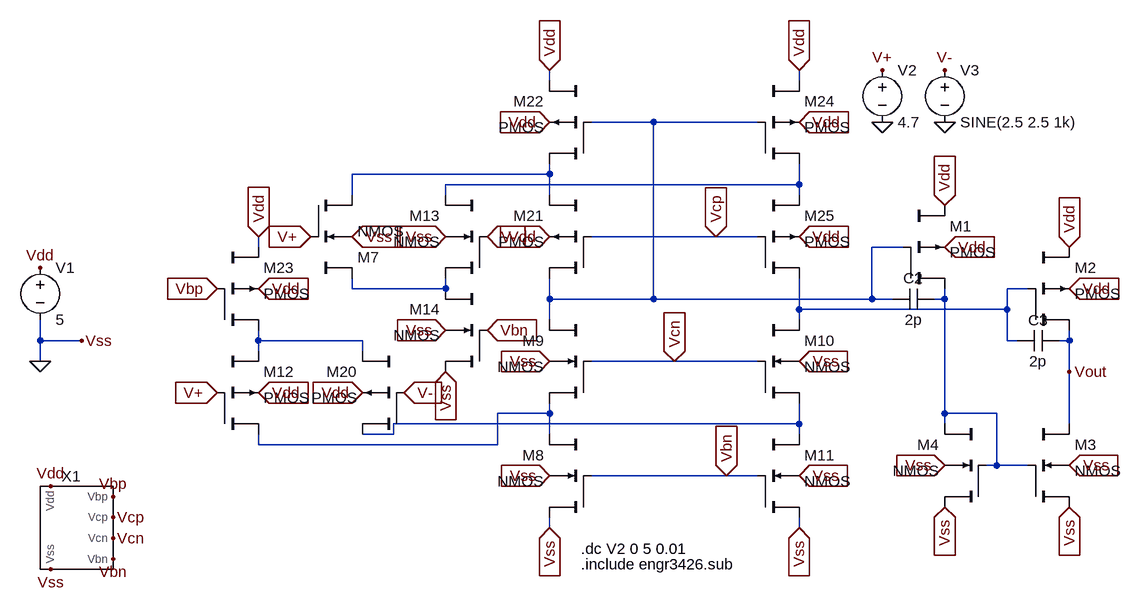
[diagram p0: schematic ampsim.asc]
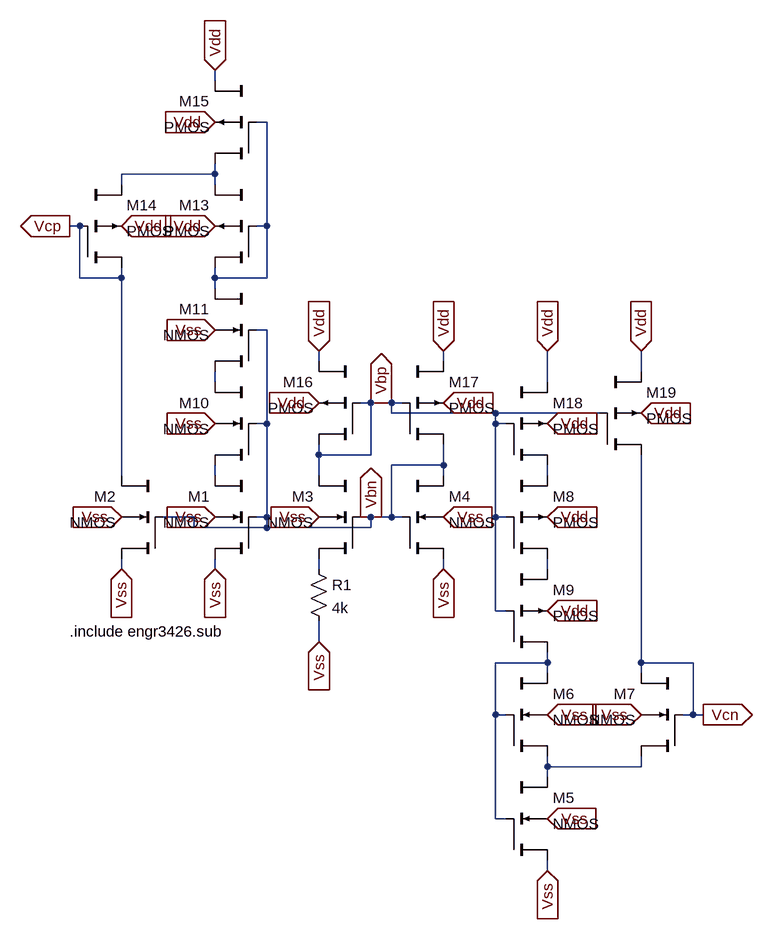
[diagram p1: sub-circuit bias.asc]
ampsim.asc, the LTspice schematic file:
Version 4
SHEET 1 2380 680
WIRE 1040 -512 1040 -528
WIRE 1424 -512 1424 -528
WIRE 1200 -448 1104 -448
WIRE 1360 -448 1200 -448
WIRE 1040 -368 1040 -384
WIRE 1040 -368 736 -368
WIRE 1424 -352 1424 -384
WIRE 1424 -352 880 -352
WIRE 736 -336 736 -368
WIRE 880 -336 880 -352
WIRE 1040 -336 1040 -368
WIRE 1424 -336 1424 -352
WIRE 1296 -272 1104 -272
WIRE 1360 -272 1296 -272
WIRE 592 -256 592 -272
WIRE 1584 -256 1536 -256
WIRE 736 -192 736 -208
WIRE 880 -192 880 -208
WIRE 880 -192 736 -192
WIRE 1776 -192 1744 -192
WIRE 1040 -176 1040 -208
WIRE 1200 -176 1200 -448
WIRE 1200 -176 1040 -176
WIRE 1536 -176 1536 -256
WIRE 1536 -176 1200 -176
WIRE 1568 -176 1536 -176
WIRE 1648 -176 1648 -192
WIRE 1648 -176 1632 -176
WIRE 1424 -160 1424 -208
WIRE 1744 -160 1744 -192
WIRE 1744 -160 1424 -160
WIRE 1040 -144 1040 -176
WIRE 1424 -144 1424 -160
WIRE 256 -112 256 -144
WIRE 320 -112 256 -112
WIRE 592 -112 592 -128
WIRE 752 -112 592 -112
WIRE 1744 -112 1744 -160
WIRE 1760 -112 1744 -112
WIRE 1840 -112 1840 -128
WIRE 1840 -112 1824 -112
WIRE 592 -96 592 -112
WIRE 752 -96 752 -112
WIRE 256 -80 256 -112
WIRE 1232 -80 1104 -80
WIRE 1360 -80 1232 -80
WIRE 1840 -64 1840 -112
WIRE 1040 0 1040 -16
WIRE 1040 0 960 0
WIRE 1648 0 1648 -176
WIRE 1728 0 1648 0
WIRE 1424 16 1424 -16
WIRE 1424 16 800 16
WIRE 1648 16 1648 0
WIRE 1840 16 1840 -64
WIRE 800 32 800 16
WIRE 800 32 752 32
WIRE 1040 32 1040 0
WIRE 1424 32 1424 16
WIRE 592 48 592 32
WIRE 960 48 960 0
WIRE 960 48 592 48
WIRE 1728 80 1728 0
WIRE 1728 80 1712 80
WIRE 1776 80 1728 80
WIRE 1312 96 1104 96
WIRE 1360 96 1312 96
WIRE 1040 176 1040 160
WIRE 1424 176 1424 160
FLAG 528 -192 Vbp
IOPIN 528 -192 In
FLAG 816 -32 V-
IOPIN 816 -32 In
FLAG 1312 96 Vbn
IOPIN 1312 96 In
FLAG 1232 -80 Vcn
IOPIN 1232 -80 In
FLAG 1296 -272 Vcp
IOPIN 1296 -272 In
FLAG 592 -272 Vdd
IOPIN 592 -272 In
FLAG 592 -192 Vdd
IOPIN 592 -192 In
FLAG 592 -32 Vdd
IOPIN 592 -32 In
FLAG 752 -32 Vdd
IOPIN 752 -32 In
FLAG 1040 -272 Vdd
IOPIN 1040 -272 In
FLAG 1040 -448 Vdd
IOPIN 1040 -448 In
FLAG 1040 -528 Vdd
IOPIN 1040 -528 In
FLAG 1424 -528 Vdd
IOPIN 1424 -528 In
FLAG 1424 -448 Vdd
IOPIN 1424 -448 In
FLAG 1424 -272 Vdd
IOPIN 1424 -272 In
FLAG 1040 -80 Vss
IOPIN 1040 -80 In
FLAG 1424 -80 Vss
IOPIN 1424 -80 In
FLAG 1040 96 Vss
IOPIN 1040 96 In
FLAG 1424 96 Vss
IOPIN 1424 96 In
FLAG 1040 176 Vss
IOPIN 1040 176 In
FLAG 1424 176 Vss
IOPIN 1424 176 In
FLAG 368 160 Vcp
FLAG 368 128 Vbp
FLAG 368 192 Vcn
FLAG 368 224 Vbn
FLAG 272 240 Vss
FLAG 272 112 Vdd
FLAG 256 -224 Vdd
FLAG 320 -112 Vss
FLAG 1648 -448 0
FLAG 1552 -448 0
FLAG 1552 -528 V+
FLAG 1648 -528 V-
FLAG 256 -80 0
FLAG 1648 80 Vss
IOPIN 1648 80 In
FLAG 1840 80 Vss
IOPIN 1840 80 In
FLAG 1648 144 Vss
IOPIN 1648 144 In
FLAG 1840 144 Vss
IOPIN 1840 144 In
FLAG 1648 -320 Vdd
IOPIN 1648 -320 In
FLAG 1648 -256 Vdd
IOPIN 1648 -256 In
FLAG 1840 -256 Vdd
IOPIN 1840 -256 In
FLAG 1840 -192 Vdd
IOPIN 1840 -192 In
FLAG 1840 -64 Vout
FLAG 944 -128 Vbn
IOPIN 944 -128 In
FLAG 880 -128 Vss
IOPIN 880 -128 In
FLAG 736 -272 Vss
IOPIN 736 -272 In
FLAG 880 -272 Vss
IOPIN 880 -272 In
FLAG 880 -64 Vss
IOPIN 880 -64 In
FLAG 944 -272 V-
IOPIN 944 -272 In
FLAG 528 -32 V+
IOPIN 528 -32 In
FLAG 672 -272 V+
IOPIN 672 -272 In
SYMBOL cktsym\\nmos4 1040 96 M0
SYMATTR InstName M8
SYMATTR Value2 l=1.8u w=36u
SYMBOL cktsym\\nmos4 1040 -80 M0
SYMATTR InstName M9
SYMATTR Value2 l=1.8u w=36u
SYMBOL cktsym\\nmos4 1424 -80 R0
SYMATTR InstName M10
SYMATTR Value2 l=1.8u w=36u
SYMBOL cktsym\\nmos4 1424 96 R0
SYMATTR InstName M11
SYMATTR Value2 l=1.8u w=36u
SYMBOL cktsym\\pmos4 592 -32 R0
SYMATTR InstName M12
SYMATTR Value2 l=1.8u w=36u
SYMBOL cktsym\\pmos4 752 -32 M0
SYMATTR InstName M20
SYMATTR Value2 l=1.8u w=36u
SYMBOL cktsym\\pmos4 1040 -272 M0
SYMATTR InstName M21
SYMATTR Value2 l=1.8u w=36u
SYMBOL cktsym\\pmos4 1040 -448 M0
SYMATTR InstName M22
SYMATTR Value2 l=1.8u w=36u
SYMBOL cktsym\\pmos4 592 -192 R0
SYMATTR InstName M23
SYMATTR Value2 l=1.8u w=36u
SYMBOL cktsym\\pmos4 1424 -448 R0
SYMATTR InstName M24
SYMATTR Value2 l=1.8u w=36u
SYMBOL cktsym\\pmos4 1424 -272 R0
SYMATTR InstName M25
SYMATTR Value2 l=1.8u w=36u
SYMBOL bias 304 176 R0
SYMATTR InstName X1
SYMBOL voltage 256 -240 R0
WINDOW 123 0 0 Left 2
WINDOW 39 0 0 Left 2
SYMATTR InstName V1
SYMATTR Value 5
SYMBOL voltage 1552 -544 R0
WINDOW 123 0 0 Left 2
WINDOW 39 0 0 Left 2
SYMATTR InstName V2
SYMATTR Value 4.7
SYMBOL voltage 1648 -544 R0
WINDOW 123 0 0 Left 2
WINDOW 39 0 0 Left 2
SYMATTR InstName V3
SYMATTR Value SINE(2.5 2.5 1k)
SYMBOL cktsym\\pmos4 1648 -256 R0
SYMATTR InstName M1
SYMATTR Value2 l=1.8u w=36u
SYMBOL cktsym\\pmos4 1840 -192 R0
SYMATTR InstName M2
SYMATTR Value2 l=1.8u w=36u
SYMBOL cktsym\\nmos4 1840 80 R0
SYMATTR InstName M3
SYMATTR Value2 l=1.8u w=36u
SYMBOL cktsym\\nmos4 1648 80 M0
SYMATTR InstName M4
SYMATTR Value2 l=1.8u w=36u
SYMBOL cap 1632 -192 R90
WINDOW 0 0 32 VBottom 2
WINDOW 3 32 32 VTop 2
SYMATTR InstName C2
SYMATTR Value 2p
SYMBOL cap 1824 -128 R90
WINDOW 0 0 32 VBottom 2
WINDOW 3 32 32 VTop 2
SYMATTR InstName C3
SYMATTR Value 2p
SYMBOL cktsym\\nmos4 736 -272 M180
SYMATTR InstName M7
SYMATTR Value2 l=1.8u w=36u
SYMBOL cktsym\\nmos4 880 -272 M0
SYMATTR InstName M13
SYMATTR Value2 l=1.8u w=36u
SYMBOL cktsym\\nmos4 880 -128 M0
SYMATTR InstName M14
SYMATTR Value2 l=1.8u w=36u
TEXT 1088 232 Left 2 !.include engr3426.sub
TEXT 1088 208 Left 2 !.dc V2 0 5 0.01

bias.asc, the sub-circuit schematic file:
Version 4
SHEET 1 1492 748
WIRE -256 -592 -256 -608
WIRE -176 -528 -192 -528
WIRE -256 -448 -256 -464
WIRE -256 -448 -400 -448
WIRE -400 -432 -400 -448
WIRE -256 -432 -256 -448
WIRE -464 -368 -480 -368
WIRE -176 -368 -176 -528
WIRE -176 -368 -192 -368
WIRE -464 -288 -464 -368
WIRE -400 -288 -400 -304
WIRE -400 -288 -464 -288
WIRE -256 -288 -256 -304
WIRE -176 -288 -176 -368
WIRE -176 -288 -256 -288
WIRE -256 -272 -256 -288
WIRE -176 -208 -192 -208
WIRE -96 -160 -96 -176
WIRE 96 -160 96 -176
WIRE 400 -144 400 -176
WIRE -256 -128 -256 -144
WIRE 256 -128 256 -176
WIRE -16 -96 -32 -96
WIRE 0 -96 -16 -96
WIRE 16 -96 0 -96
WIRE 32 -96 16 -96
WIRE 16 -80 16 -96
WIRE 176 -80 16 -80
WIRE 336 -80 176 -80
WIRE -176 -64 -176 -208
WIRE -176 -64 -192 -64
WIRE 176 -64 176 -80
WIRE 192 -64 176 -64
WIRE -96 -16 -96 -32
WIRE -16 -16 -16 -96
WIRE -16 -16 -96 -16
WIRE 96 0 96 -32
WIRE 96 0 16 0
WIRE -400 16 -400 -288
WIRE -256 16 -256 0
WIRE -96 16 -96 -16
WIRE 96 16 96 0
WIRE 256 16 256 0
WIRE -288 80 -336 80
WIRE -176 80 -176 -64
WIRE -176 80 -192 80
WIRE -16 80 -32 80
WIRE 16 80 16 0
WIRE 16 80 -16 80
WIRE 32 80 16 80
WIRE 176 80 176 -64
WIRE 192 80 176 80
WIRE -288 96 -288 80
WIRE -176 96 -176 80
WIRE -176 96 -288 96
WIRE -16 96 -16 80
WIRE -16 96 -176 96
WIRE -400 160 -400 144
WIRE -256 160 -256 144
WIRE -96 160 -96 144
WIRE 96 160 96 144
WIRE 256 160 256 144
WIRE 176 224 176 80
WIRE 192 224 176 224
WIRE -96 272 -96 240
WIRE 256 304 256 288
WIRE 256 304 176 304
WIRE 400 304 400 -16
WIRE 480 304 400 304
WIRE 256 320 256 304
WIRE 400 320 400 304
WIRE 176 384 176 304
WIRE 192 384 176 384
WIRE 480 384 480 304
WIRE 480 384 464 384
WIRE 496 384 480 384
WIRE 256 464 256 448
WIRE 400 464 400 448
WIRE 400 464 256 464
WIRE 256 480 256 464
WIRE 176 544 176 384
WIRE 192 544 176 544
WIRE 256 624 256 608
FLAG 0 -96 Vbp
IOPIN 0 -96 Out
FLAG -16 80 Vbn
IOPIN -16 80 Out
FLAG -400 160 Vss
IOPIN -400 160 In
FLAG -400 80 Vss
IOPIN -400 80 In
FLAG -256 80 Vss
IOPIN -256 80 In
FLAG -256 160 Vss
IOPIN -256 160 In
FLAG -96 80 Vss
IOPIN -96 80 In
FLAG 96 80 Vss
IOPIN 96 80 In
FLAG 96 160 Vss
IOPIN 96 160 In
FLAG 256 624 Vss
IOPIN 256 624 In
FLAG 256 544 Vss
IOPIN 256 544 In
FLAG 400 384 Vss
IOPIN 400 384 In
FLAG 256 384 Vss
IOPIN 256 384 In
FLAG -96 -96 Vdd
IOPIN -96 -96 In
FLAG -256 -368 Vdd
IOPIN -256 -368 In
FLAG -400 -368 Vdd
IOPIN -400 -368 In
FLAG -256 -528 Vdd
IOPIN -256 -528 In
FLAG -96 -176 Vdd
IOPIN -96 -176 In
FLAG 96 -176 Vdd
IOPIN 96 -176 In
FLAG 256 -176 Vdd
IOPIN 256 -176 In
FLAG 400 -176 Vdd
IOPIN 400 -176 In
FLAG 400 -80 Vdd
IOPIN 400 -80 In
FLAG 256 -64 Vdd
IOPIN 256 -64 In
FLAG 96 -96 Vdd
IOPIN 96 -96 In
FLAG -256 -608 Vdd
IOPIN -256 -608 In
FLAG 496 384 Vcn
IOPIN 496 384 Out
FLAG -480 -368 Vcp
IOPIN -480 -368 Out
FLAG 256 80 Vdd
IOPIN 256 80 In
FLAG 256 224 Vdd
IOPIN 256 224 In
FLAG -256 -64 Vss
IOPIN -256 -64 In
FLAG -256 -208 Vss
IOPIN -256 -208 In
FLAG -96 272 Vss
IOPIN -96 272 In
SYMBOL cktsym\\nmos4 -256 80 M0
SYMATTR InstName M1
SYMATTR Value2 l=1.8u w=36u
SYMBOL cktsym\\nmos4 -400 80 M0
SYMATTR InstName M2
SYMATTR Value2 l=1.8u w=36u
SYMBOL cktsym\\nmos4 -96 80 M0
SYMATTR InstName M3
SYMATTR Value2 l=1.8u w=72u
SYMBOL cktsym\\nmos4 96 80 R0
SYMATTR InstName M4
SYMATTR Value2 l=1.8u w=36u
SYMBOL cktsym\\nmos4 256 544 R0
SYMATTR InstName M5
SYMATTR Value2 l=1.8u w=36u
SYMBOL cktsym\\nmos4 256 384 R0
SYMATTR InstName M6
SYMATTR Value2 l=1.8u w=36u m=2
SYMBOL cktsym\\nmos4 400 384 M0
SYMATTR InstName M7
SYMATTR Value2 l=1.8u w=36u
SYMBOL cktsym\\pmos4 -256 -368 M0
SYMATTR InstName M13
SYMATTR Value2 l=1.8u w=36u m=2
SYMBOL cktsym\\pmos4 -400 -368 R0
SYMATTR InstName M14
SYMATTR Value2 l=1.8u w=36u
SYMBOL cktsym\\pmos4 -256 -528 M0
SYMATTR InstName M15
SYMATTR Value2 l=1.8u w=36u
SYMBOL cktsym\\pmos4 -96 -96 M0
SYMATTR InstName M16
SYMATTR Value2 l=1.8u w=36u
SYMBOL cktsym\\pmos4 96 -96 R0
SYMATTR InstName M17
SYMATTR Value2 l=1.8u w=36u
SYMBOL cktsym\\pmos4 256 -64 R0
SYMATTR InstName M18
SYMATTR Value2 l=1.8u w=36u
SYMBOL cktsym\\pmos4 400 -80 R0
SYMATTR InstName M19
SYMATTR Value2 l=1.8u w=36u
SYMBOL cktsym\\pmos4 256 80 R0
SYMATTR InstName M8
SYMATTR Value2 l=1.8u w=36u
SYMBOL cktsym\\pmos4 256 224 R0
SYMATTR InstName M9
SYMATTR Value2 l=1.8u w=36u
SYMBOL cktsym\\nmos4 -256 -64 M0
SYMATTR InstName M10
SYMATTR Value2 l=1.8u w=36u
SYMBOL cktsym\\nmos4 -256 -208 M0
SYMATTR InstName M11
SYMATTR Value2 l=1.8u w=36u
SYMBOL res -112 144 R0
SYMATTR InstName R1
SYMATTR Value 4k
TEXT -480 256 Left 2 !.include engr3426.sub

The netlist it stands for:
* ampsim.asc
M8 N008 Vbn 0 0 NMOS l=1.8u w=36u
M9 N001 Vcn N008 0 NMOS l=1.8u w=36u
M10 N005 Vcn N009 0 NMOS l=1.8u w=36u
M11 N009 Vbn 0 0 NMOS l=1.8u w=36u
M12 N008 V+ N007 Vdd PMOS l=1.8u w=36u
M20 N009 V- N007 Vdd PMOS l=1.8u w=36u
M21 N001 Vcp N002 Vdd PMOS l=1.8u w=36u
M22 N002 N001 Vdd Vdd PMOS l=1.8u w=36u
M23 N007 Vbp Vdd Vdd PMOS l=1.8u w=36u
M24 N003 N001 Vdd Vdd PMOS l=1.8u w=36u
M25 N005 Vcp N003 Vdd PMOS l=1.8u w=36u
XX1 Vdd 0 Vbn Vbp Vcn Vcp bias
V1 Vdd 0 5
V2 V+ 0 4.7
V3 V- 0 SINE(2.5 2.5 1k)
M1 N006 N001 Vdd Vdd PMOS l=1.8u w=36u
M2 Vout N005 Vdd Vdd PMOS l=1.8u w=36u
M3 Vout N006 0 0 NMOS l=1.8u w=36u
M4 N006 N006 0 0 NMOS l=1.8u w=36u
C2 N006 N001 2p
C3 Vout N005 2p
M7 N004 V+ N002 0 NMOS l=1.8u w=36u
M13 N003 V- N004 0 NMOS l=1.8u w=36u
M14 N004 Vbn 0 0 NMOS l=1.8u w=36u

* block symbol definitions
.subckt bias Vdd Vss Vbn Vbp Vcn Vcp
M1 N004 Vbn Vss Vss NMOS l=1.8u w=36u
M2 Vcp Vbn Vss Vss NMOS l=1.8u w=36u
M3 Vbp Vbn N006 Vss NMOS l=1.8u w=72u
M4 Vbn Vbn Vss Vss NMOS l=1.8u w=36u
M5 N009 N008 Vss Vss NMOS l=1.8u w=36u
M6 N008 N008 N009 Vss NMOS l=1.8u w=36u m=2
M7 Vcn Vcn N009 Vss NMOS l=1.8u w=36u
M13 N001 N001 N002 Vdd PMOS l=1.8u w=36u m=2
M14 Vcp Vcp N002 Vdd PMOS l=1.8u w=36u
M15 N002 N001 Vdd Vdd PMOS l=1.8u w=36u
M16 Vbp Vbp Vdd Vdd PMOS l=1.8u w=36u
M17 Vbn Vbp Vdd Vdd PMOS l=1.8u w=36u
M18 N005 Vbp Vdd Vdd PMOS l=1.8u w=36u
M19 Vcn Vbp Vdd Vdd PMOS l=1.8u w=36u
M8 N007 Vbp N005 Vdd PMOS l=1.8u w=36u
M9 N008 Vbp N007 Vdd PMOS l=1.8u w=36u
M10 N003 Vbn N004 Vss NMOS l=1.8u w=36u
M11 N001 Vbn N003 Vss NMOS l=1.8u w=36u
R1 N006 Vss 4k
.include engr3426.sub
.ends bias

.model NMOS NMOS
.model PMOS PMOS
.lib standard.mos
.include engr3426.sub
.dc V2 0 5 0.01
.backanno
.end